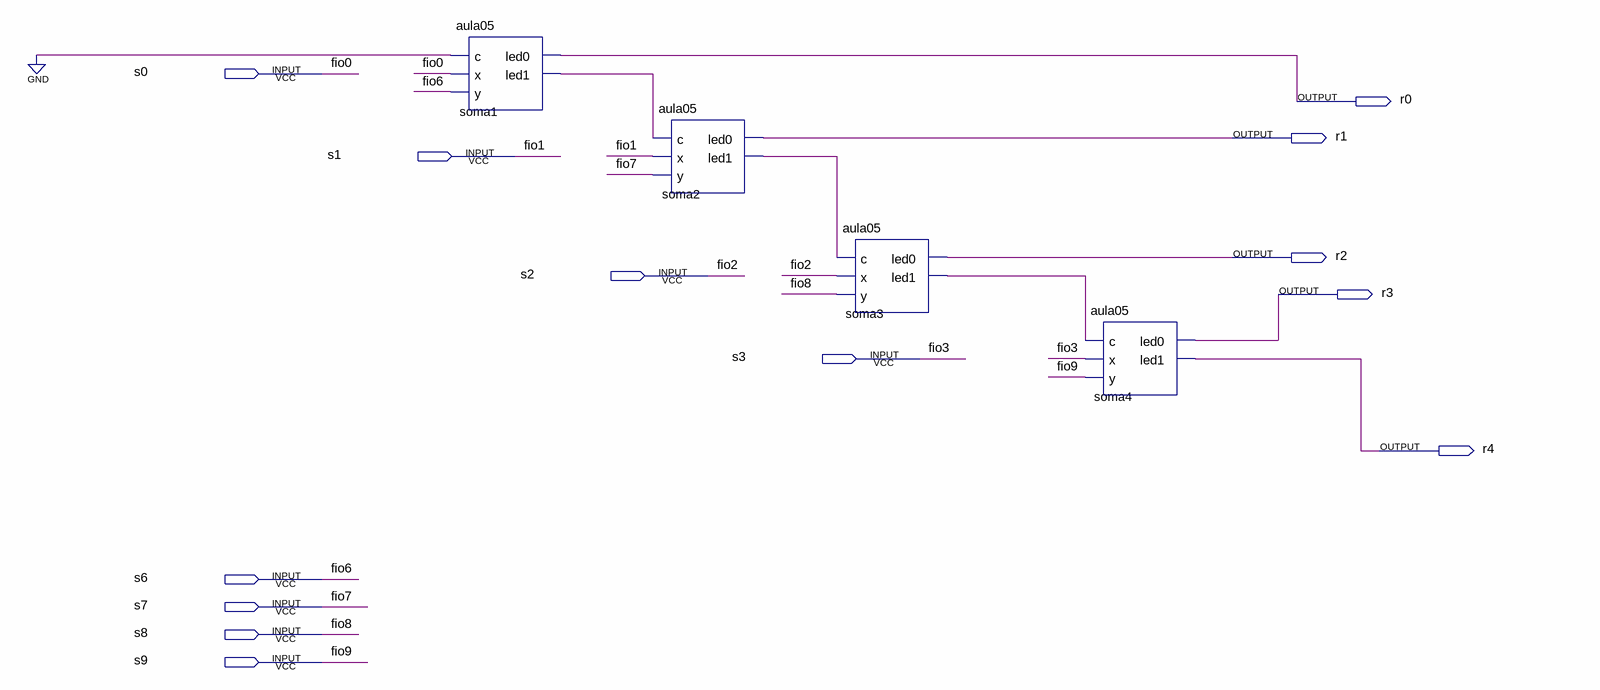
[diagram p0: schematic sheet]
// Quartus schematic aula06.bdf as structural Verilog: 4 symbols, 13 pins
module aula06 (
  input  s0,
  input  s1,
  input  s2,
  input  s3,
  input  s6,
  input  s7,
  input  s8,
  input  s9,
  output r0,
  output r1,
  output r2,
  output r3,
  output r4
);

  wire soma1_led1, soma2_led1, soma3_led1;

  aula05 soma1 (.c(1'b0), .x(s0), .y(s6), .led0(r0), .led1(soma1_led1));
  aula05 soma2 (.c(soma1_led1), .x(s1), .y(s7), .led0(r1), .led1(soma2_led1));
  aula05 soma3 (.c(soma2_led1), .x(s2), .y(s8), .led0(r2), .led1(soma3_led1));
  aula05 soma4 (.c(soma3_led1), .x(s3), .y(s9), .led0(r3), .led1(r4));

  // Other names for the same wires on the sheet: fio0 = s0; fio1 = s1; fio2 = s2; fio3 = s3; fio6 = s6; fio7 = s7;
  //   fio8 = s8; fio9 = s9
endmodule
